# EAGLE design breakout-r1 (EAGLE 8.3.1)
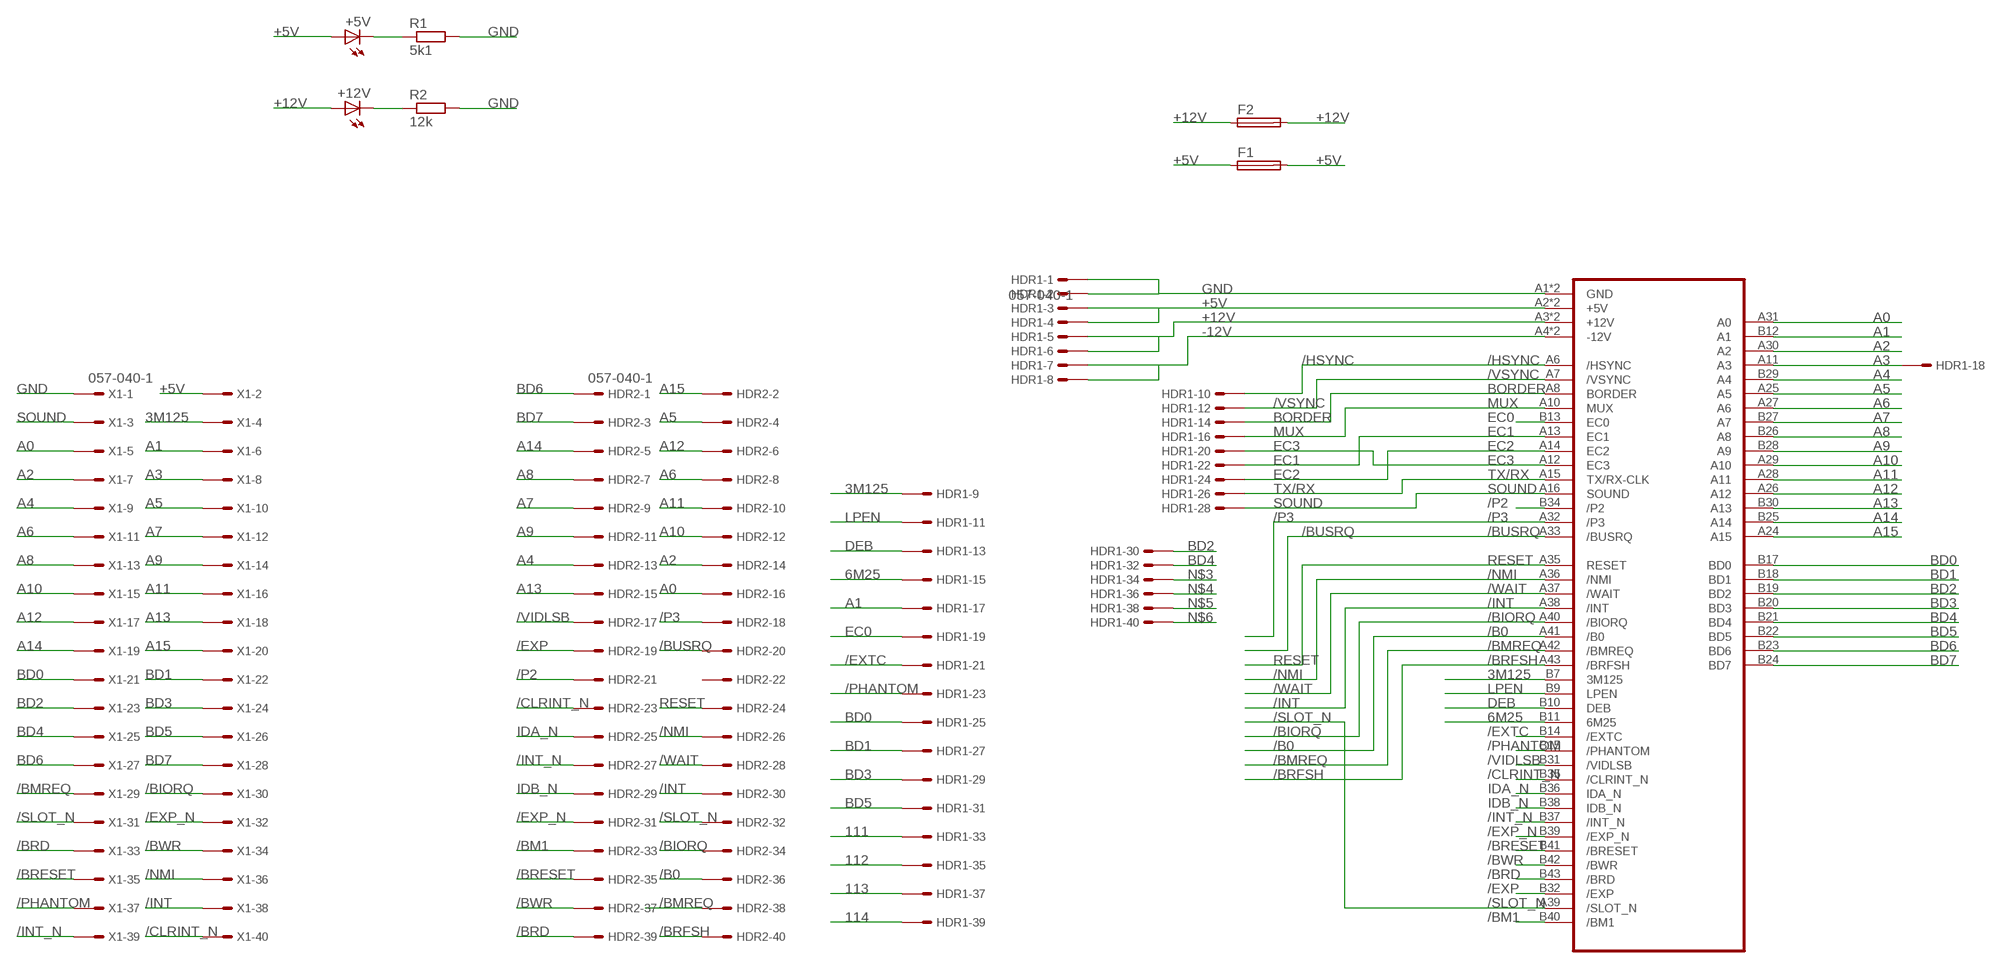
[diagram p0: schematic, sheet 1]

## Parts
+5V  LED3MM  [LED3MM]
+12V  LED3MM  [LED3MM]
F1  TE5  [TE5]
F2  TE5  [TE5]
HDR1  057-040-1  [057-040-1]
HDR2  057-040-1  [057-040-1]
R1  5k1  R-EU_0204/5  [0204/5]
R2  12k  R-EU_0204/5  [0204/5]
U$1  TVC-EXP-HBA-COMMON  [TVC-EXP-EDGE]
X1  057-040-1  [057-040-1]

## Nets
3M125: HDR1.9 U$1.B7(3M125) X1.4
6M25: HDR1.15 U$1.B11(6M25)
111: HDR1.33
112: HDR1.35
113: HDR1.37
114: HDR1.39
+5V [pwr]: +5V.A F1.1 F1.2 HDR1.3 HDR1.4 U$1.A2(+5V) U$1.B2(+5V) X1.2
+12V [pwr]: +12V.A F2.1 F2.2 HDR1.5 HDR1.6 U$1.A3(+12V) U$1.B3(+12V)
-12V [pwr]: HDR1.7 HDR1.8 U$1.A4(-12V) U$1.B4(-12V)
/B0: HDR2.36 U$1.A41(/B0)
/BIORQ: HDR2.34 U$1.A40(/BIORQ) X1.30
/BM1: HDR2.33 U$1.B40(/BM1)
/BMREQ: HDR2.38 U$1.A42(/BMREQ) X1.29
/BRD: HDR2.39 U$1.B43(/BRD) X1.33
/BRESET: HDR2.35 U$1.B41(/BRESET) X1.35
/BRFSH: HDR2.40 U$1.A43(/BRFSH)
/BUSRQ: HDR2.20 U$1.A33(/BUSRQ)
/BWR: HDR2.37 U$1.B42(/BWR) X1.34
/CLRINT_N: HDR2.23 U$1.B35(/CLRINT_N) X1.40
/EXP: HDR2.19 U$1.B32(/EXP)
/EXP_N: HDR2.31 U$1.B39(/EXP_N) X1.32
/EXTC: HDR1.21 U$1.B14(/EXTC)
/HSYNC: HDR1.10 U$1.A6(/HSYNC)
/INT: HDR2.30 U$1.A38(/INT) X1.38
/INT_N: HDR2.27 U$1.B37(/INT_N) X1.39
/NMI: HDR2.26 U$1.A36(/NMI) X1.36
/P2: HDR2.21 U$1.B34(/P2)
/P3: HDR2.18 U$1.A32(/P3)
/PHANTOM: HDR1.23 U$1.B15(/PHANTOM) X1.37
/SLOT_N: HDR2.32 U$1.A39(/SLOT_N) X1.31
/VIDLSB: HDR2.17 U$1.B31(/VIDLSB)
/VSYNC: HDR1.12 U$1.A7(/VSYNC)
/WAIT: HDR2.28 U$1.A37(/WAIT)
A0: HDR2.16 U$1.A31(A0) X1.5
A1: HDR1.17 U$1.B12(A1) X1.6
A2: HDR2.14 U$1.A30(A2) X1.7
A3: HDR1.18 U$1.A11(A3) X1.8
A4: HDR2.13 U$1.B29(A4) X1.9
A5: HDR2.4 U$1.A25(A5) X1.10
A6: HDR2.8 U$1.A27(A6) X1.11
A7: HDR2.9 U$1.B27(A7) X1.12
A8: HDR2.7 U$1.B26(A8) X1.13
A9: HDR2.11 U$1.B28(A9) X1.14
A10: HDR2.12 U$1.A29(A10) X1.15
A11: HDR2.10 U$1.A28(A11) X1.16
A12: HDR2.6 U$1.A26(A12) X1.17
A13: HDR2.15 U$1.B30(A13) X1.18
A14: HDR2.5 U$1.B25(A14) X1.19
A15: HDR2.2 U$1.A24(A15) X1.20
BD0: HDR1.25 U$1.B17(BD0) X1.21
BD1: HDR1.27 U$1.B18(BD1) X1.22
BD2: HDR1.30 U$1.B19(BD2) X1.23
BD3: HDR1.29 U$1.B20(BD3) X1.24
BD4: HDR1.32 U$1.B21(BD4) X1.25
BD5: HDR1.31 U$1.B22(BD5) X1.26
BD6: HDR2.1 U$1.B23(BD6) X1.27
BD7: HDR2.3 U$1.B24(BD7) X1.28
BORDER: HDR1.14 U$1.A8(BORDER)
DEB: HDR1.13 U$1.B10(DEB)
EC0: HDR1.19 U$1.B13(EC0)
EC1: HDR1.22 U$1.A13(EC1)
EC2: HDR1.24 U$1.A14(EC2)
EC3: HDR1.20 U$1.A12(EC3)
GND [pwr]: HDR1.1 HDR1.2 R1.2 R2.2 U$1.A1(GND) U$1.B1(GND) X1.1
IDA_N: HDR2.25 U$1.B36(IDA_N)
IDB_N: HDR2.29 U$1.B38(IDB_N)
LPEN: HDR1.11 U$1.B9(LPEN)
MUX: HDR1.16 U$1.A10(MUX)
N$1: +5V.K(C) R1.1
N$2: +12V.K(C) R2.1
N$3: HDR1.34
N$4: HDR1.36
N$5: HDR1.38
N$6: HDR1.40
RESET: HDR2.24 U$1.A35(RESET)
SOUND: HDR1.28 U$1.A16(SOUND) X1.3
TX/RX: HDR1.26 U$1.A15(TX/RX-CLK)
Unconnected: HDR2.22

## Library data of the parts
+5V +12V = led:LED: LED OSRAM: - CHIPLED LG R971, LG N971, LY N971, LG Q971, LY Q971, LO R971, LY R971 LH N974, LH R974 LS Q976, LO Q976, LY Q976 LO Q996 - Hyper CHIPLED LW Q18S LB Q993, LB Q99A, LB R99A - SideLED LS A670, LO A670, LY A670, LG A670, LP A670 LB A673, LV A673, LT A673, LW A673 LH A674 LY A675 LS A676, LA A676, LO A676, LY A676, LW A676 LS A679, LY A679, LG A679 - Hyper Micro SIDELED® LS Y876, LA Y876, LO Y876, LY Y876 LT Y87S - SmartLED LW L88C, LW L88S LB L89C, LB L89S, LG L890 LS L89K, LO L89K, LY L89K LS L896, LA L896, LO L896, LY L896 - TOPLED LS T670, LO T670, LY T670, LG T670, LP T670 LSG T670, LSP T670, LSY T670, LOP T670, LYG T670 LG T671, LOG T671, LSG T671 LB T673, LV T673, LT T673, LW T673 LH T674 LS T676, LA T676, LO T676, LY T676, LB T676, LH T676, LSB T676, LW T676 LB T67C, LV T67C, LT T67C, LS T67K, LO T67K, LY T67K, LW E67C LS E67B, LA E67B, LO E67B, LY E67B, LB E67C, LV E67C, LT E67C LW T67C LS T679, LY T679, LG T679 LS T770, LO T770, LY T770, LG T770, LP T770 LB T773, LV T773, LT T773, LW T773 LH T774 LS E675, LA E675, LY E675, LS T675 LS T776, LA T776, LO T776, LY T776, LB T776 LHGB T686 LT T68C, LB T68C - Hyper Mini TOPLED® LB M676 - Mini TOPLED Santana® LG M470 LS M47K, LO M47K, LY M47K Source: http://www.osram.convergy.de LUXEON: - LUMILED® LXK2-PW12-R00, LXK2-PW12-S00, LXK2-PW14-U00, LXK2-PW14-V00 LXK2-PM12-R00, LXK2-PM12-S00, LXK2-PM14-U00 LXK2-PE12-Q00, LXK2-PE12-R00, LXK2-PE12-S00, LXK2-PE14-T00, LXK2-PE14-U00 LXK2-PB12-K00, LXK2-PB12-L00, LXK2-PB12-M00, LXK2-PB14-N00, LXK2-PB14-P00, LXK2-PB14-Q00 LXK2-PR12-L00, LXK2-PR12-M00, LXK2-PR14-Q00, LXK2-PR14-R00 LXK2-PD12-Q00, LXK2-PD12-R00, LXK2-PD12-S00 LXK2-PH12-R00, LXK2-PH12-S00 LXK2-PL12-P00, LXK2-PL12-Q00, LXK2-PL12-R00 Source: www.luxeon.com KINGBRIGHT: KA-3528ASYC Source: www.kingbright.com
F1 F2 = fuse:TE5: FUSE Wickmann; OC_FARNELL: unknown; OC_NEWARK: unknown
HDR1 HDR2 X1 = con-panduit:057-040-: CONNECTOR 40-pin series 057 contact pc board low profile headers; OC_FARNELL: unknown; OC_NEWARK: unknown
R1 R2 = resistor:R-EU_: RESISTOR, European symbol
U$1 = tvc-exp:TVC-EXP-HBA-COMMON: Videoton TV-Computer expansion port edge connector, common pins for 32k, 64k and 64k+

## Net classes
0 default: width 0.254 mm
1 pwr: width 0.508 mm, clearance 0.254 mm

## Board
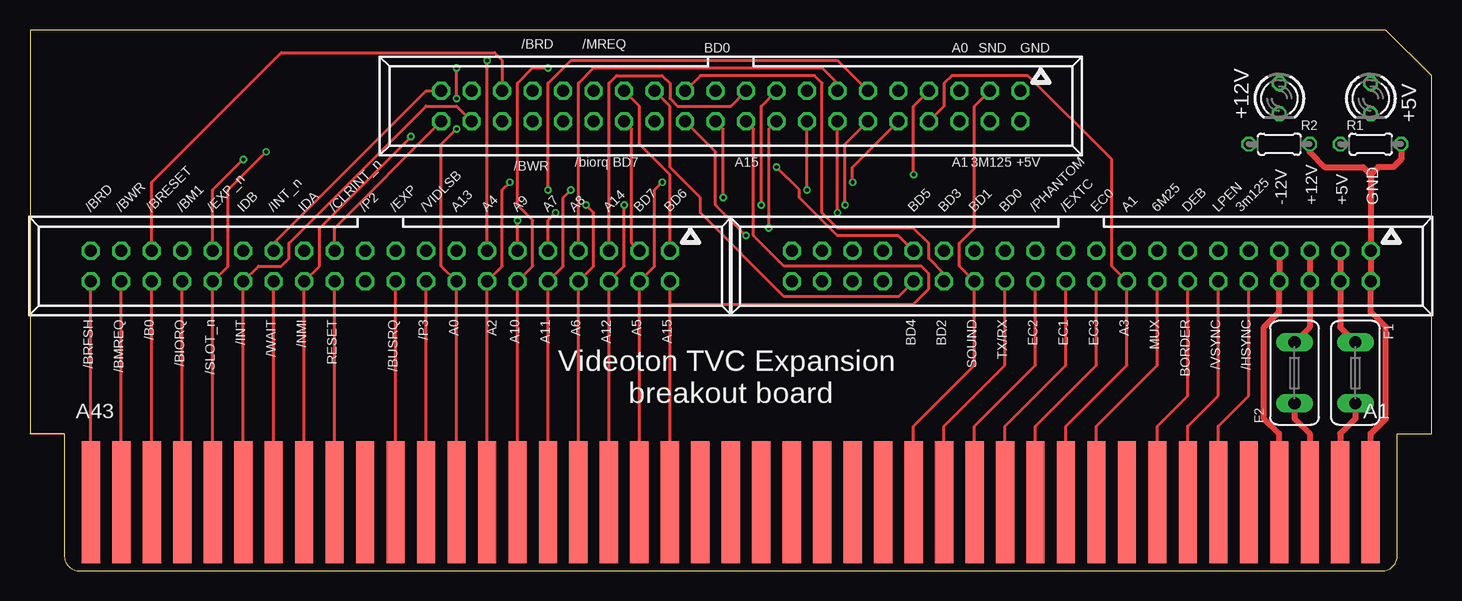
[diagram p1: board, top side]
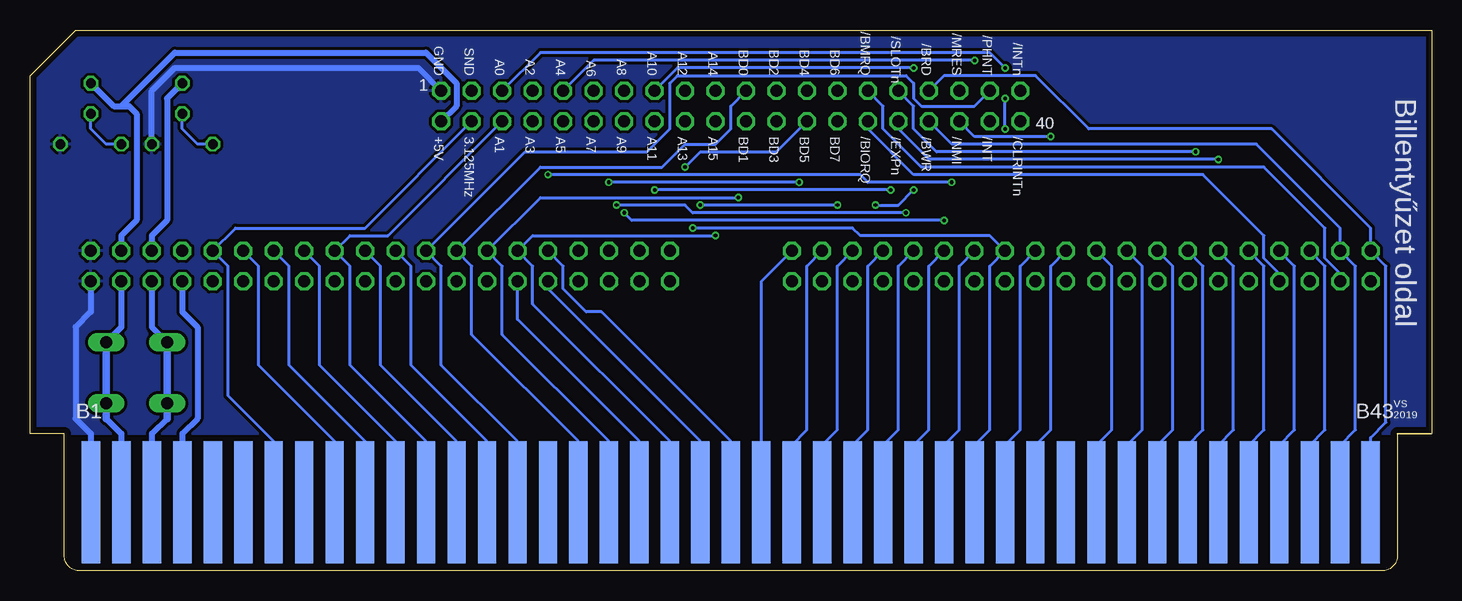
[diagram p2: board, bottom side, seen from below]

Size 116.84 x 45.08 mm. Coordinates in mm from the lower left corner, seen from the top.
Outline: 113.98,11.43 116.84,11.43 116.84,41.27 113.03,45.08 0,45.08 0,11.43 2.86,11.43
Copper layers (1*16): Top 0.035mm / dielectric 1.6mm / Bottom 0.035mm
Design rules "Elecrow_2-layer_PCB_eagle_rule": minimum track width 6mil, minimum drill 12mil, track to track 6mil, track to pad 6mil, pad to pad 6mil, via to via 8mil, smd to smd 0mil, copper to edge 20mil, drill to drill 10mil, minimum pad ring 6mil, minimum via ring 6mil, stop-mask expansion 0mil, vias tented up to drill 100mil, thermal gap 10mil

### Footprints (pad centres in the part's own frame; a part is rotated, then mirrored left to right if it is on the bottom)
LED3MM = drill 0.813 octagon: A -1.27,0; K 1.27,0
TE5 = drill 1.016 long: 1 -2.54,0; 2 2.54,0
057-040-1 = drill 1 octagon: 1 -24.13,-1.27; 2 -24.13,1.27; 3 -21.59,-1.27; 4 -21.59,1.27; 5 -19.05,-1.27; 6 -19.05,1.27; 7 -16.51,-1.27; 8 -16.51,1.27; 9 -13.97,-1.27; 10 -13.97,1.27; 11 -11.43,-1.27; 12 -11.43,1.27; 13 -8.89,-1.27; 14 -8.89,1.27; 15 -6.35,-1.27; 16 -6.35,1.27; 17 -3.81,-1.27; 18 -3.81,1.27; 19 -1.27,-1.27; 20 -1.27,1.27; 21 1.27,-1.27; 22 1.27,1.27; 23 3.81,-1.27; 24 3.81,1.27; 25 6.35,-1.27; 26 6.35,1.27; 27 8.89,-1.27; 28 8.89,1.27; 29 11.43,-1.27; 30 11.43,1.27; 31 13.97,-1.27; 32 13.97,1.27; 33 16.51,-1.27; 34 16.51,1.27; 35 19.05,-1.27; 36 19.05,1.27; 37 21.59,-1.27; 38 21.59,1.27; 39 24.13,-1.27; 40 24.13,1.27
0204/5 = drill 0.813 octagon: 1 -2.54,0; 2 2.54,0
TVC-EXP-EDGE = smd 1.524 x 10.16: A1 53.34,-5.715; A2 50.8,-5.715; A3 48.26,-5.715; A4 45.72,-5.715; A5 43.18,-5.715; A6 40.64,-5.715; A7 38.1,-5.715; A8 35.56,-5.715; A9 33.02,-5.715; A10 30.48,-5.715; A11 27.94,-5.715; A12 25.4,-5.715; A13 22.86,-5.715; A14 20.32,-5.715; A15 17.78,-5.715; A16 15.24,-5.715; A17 12.7,-5.715; A18 10.16,-5.715; A19 7.62,-5.715; A20 5.08,-5.715; A21 2.54,-5.715; A22 0,-5.715; A23 -2.54,-5.715; A24 -5.08,-5.715; A25 -7.62,-5.715; A26 -10.16,-5.715; A27 -12.7,-5.715; A28 -15.24,-5.715; A29 -17.78,-5.715; A30 -20.32,-5.715; A31 -22.86,-5.715; A32 -25.4,-5.715; A33 -27.94,-5.715; A34 -30.48,-5.715; A35 -33.02,-5.715; A36 -35.56,-5.715; A37 -38.1,-5.715; A38 -40.64,-5.715; A39 -43.18,-5.715; A40 -45.72,-5.715; A41 -48.26,-5.715; A42 -50.8,-5.715; A43 -53.34,-5.715 | smd 1.524 x 10.16 bottom: B1 53.34,-5.715; B2 50.8,-5.715; B3 48.26,-5.715; B4 45.72,-5.715; B5 43.18,-5.715; B6 40.64,-5.715; B7 38.1,-5.715; B8 35.56,-5.715; B9 33.02,-5.715; B10 30.48,-5.715; B11 27.94,-5.715; B12 25.4,-5.715; B13 22.86,-5.715; B14 20.32,-5.715; B15 17.78,-5.715; B16 15.24,-5.715; B17 12.7,-5.715; B18 10.16,-5.715; B19 7.62,-5.715; B20 5.08,-5.715; B21 2.54,-5.715; B22 0,-5.715; B23 -2.54,-5.715; B24 -5.08,-5.715; B25 -7.62,-5.715; B26 -10.16,-5.715; B27 -12.7,-5.715; B28 -15.24,-5.715; B29 -17.78,-5.715; B30 -20.32,-5.715; B31 -22.86,-5.715; B32 -25.4,-5.715; B33 -27.94,-5.715; B34 -30.48,-5.715; B35 -33.02,-5.715; B36 -35.56,-5.715; B37 -38.1,-5.715; B38 -40.64,-5.715; B39 -43.18,-5.715; B40 -45.72,-5.715; B41 -48.26,-5.715; B42 -50.8,-5.715; B43 -53.34,-5.715

### Placement (x,y rotation side)
+5V  111.76,39.37 270 top
+12V  104.14,39.37 270 top
F1  110.49,16.51 90 top
F2  105.41,16.51 90 top
HDR1  87.63,25.4 180 top
HDR2  29.21,25.4 180 top
R1  111.76,35.56 0 top
R2  104.14,35.56 0 top
U$1  58.42,11.43 0 top
X1  58.42,38.73 180 top

### Tracks (layer width: path | path; a pad name or v marks a point on that pad's centre or on a via)
3M125
  Bottom 0.254: U$1.B7 96.52,10.79 100.33,14.61 100.33,25.4 HDR1.9 99.7,28.57 88.9,28.57 X1.4
6M25
  Bottom 0.254: HDR1.15 92.71,25.4 92.71,17.14 86.36,10.79 U$1.B11
+5V
  Top 0.508: HDR1.3 HDR1.4 109.22,20.32 F1.2 | F1.1 110.49,12.7 109.22,11.43 U$1.B2
  Bottom 0.508: HDR1.4 109.22,20.32 F1.2 | 110.49,12.7 109.22,11.43 U$1.B2 | +5V.A 109.86,38.73 109.22,38.73 | 109.22,38.73 108.59,38.73 107.95,38.1 107.95,29.21 109.22,27.94 HDR1.3 | X1.2 81.28,38.73 81.28,40.64 83.82,43.18 104.78,43.18 109.22,38.73
  Bottom 0.61: F1.2 F1.1 110.49,12.7
+12V
  Top 0.508: HDR1.5 HDR1.6 106.68,20.32 F2.2 | F2.1 105.41,12.7 106.68,11.43 U$1.B3
  Bottom 0.508: HDR1.6 106.68,20.32 F2.2 | 105.41,12.7 106.68,11.43 U$1.B3 | +12V.A 105.41,39.37 105.41,29.21 106.68,27.94 HDR1.5
  Bottom 0.61: F2.2 F2.1 105.41,12.7
-12V
  Top 0.508: HDR1.7 HDR1.8 104.14,21.59 102.87,20.32 102.87,12.7 104.14,11.43 U$1.B4
  Bottom 0.508: HDR1.8 104.14,21.59 102.87,20.32 102.87,12.7 104.14,11.43 U$1.B4
/B0
  Top 0.254: U$1.A41 HDR2.36
/BIORQ
  Top 0.254: U$1.A40 HDR2.34
  Bottom 0.254: X1.30 46.99,36.83 43.18,33.02 19.05,33.02 13.97,27.94 13.97,26.04 12.7,24.77 HDR2.34
/BM1
  Bottom 0.254: HDR2.33 11.43,25.4 11.43,11.75 12.7,10.48 U$1.B40
/BMREQ
  Top 0.254: U$1.A42 HDR2.38
  Bottom 0.254: X1.29 45.72,38.73 45.72,36.83 42.54,33.66 13.97,33.66 8.89,28.57 8.89,26.04 7.62,24.77 HDR2.38
/BRD
  Bottom 0.254: U$1.B43 5.08,11.11 3.81,12.38 3.81,25.4 HDR2.39 5.08,28.57 13.34,36.83 28.57,36.83 33.02,41.27 40.64,41.27 X1.33
/BRESET
  Top 0.254: X1.35 39.37,42.55 38.73,43.18 20.96,43.18 10.16,32.38 HDR2.35
  Bottom 0.254: HDR2.35 8.89,25.4 8.89,11.75 10.16,10.48 U$1.B41
/BRFSH
  Top 0.254: U$1.A43 HDR2.40
/BUSRQ
  Top 0.254: U$1.A33 HDR2.20
/BWR
  Bottom 0.254: U$1.B42 7.62,10.48 6.35,11.75 6.35,25.4 HDR2.37 7.62,28.57 14.61,35.56 40,35.56 X1.34
/CLRINT_N
  Top 0.254: X1.40 25.4,28.57 HDR2.23
  Bottom 0.254: HDR2.23 24.13,25.4 24.13,11.75 25.4,10.48 U$1.B35
/EXP
  Bottom 0.254: HDR2.19 31.75,25.4 31.75,11.75 33.02,10.48 U$1.B32
/EXP_N  (via drill 0.3)
  Top 0.254: v17.78,34.29 15.24,31.75 HDR2.31
  Bottom 0.254: HDR2.31 13.97,25.4 13.97,11.75 15.24,10.48 U$1.B39 | X1.32 44.45,36.83 41.91,34.29 v17.78,34.29
/EXTC
  Bottom 0.254: U$1.B14 78.74,10.79 85.09,17.14 85.09,25.4 HDR1.21
/HSYNC
  Top 0.254: HDR1.10 101.6,14.61 99.06,12.06 U$1.A6
/INT
  Top 0.254: U$1.A38 HDR2.30 19.05,25.4 20.96,25.4 21.59,26.04 21.59,27.3 33.02,38.73 35.56,38.73 X1.38
/INT_N
  Top 0.254: X1.39 33.02,40.01 20.32,27.3 HDR2.27
  Bottom 0.254: HDR2.27 19.05,25.4 19.05,11.75 20.32,10.48 U$1.B37
/NMI  (via drill 0.3)
  Top 0.254: U$1.A36 HDR2.26 24.13,25.4 24.13,28.57 v31.75,36.2
  Bottom 0.254: X1.36 38.1,36.2 v31.75,36.2
/P2
  Bottom 0.254: HDR2.21 26.67,25.4 26.67,11.75 27.94,10.48 U$1.B34
/P3
  Top 0.254: U$1.A32 HDR2.18
/PHANTOM
  Bottom 0.254: U$1.B15 76.2,10.79 82.55,17.14 82.55,25.4 HDR1.23 75.56,34.92 65.41,34.92 63.5,36.83 63.5,40.64 62.87,41.27 43.81,41.27 43.18,40.64 43.18,39.37 42.54,38.73 38.1,38.73 X1.37
/SLOT_N  (via drill 0.3)
  Top 0.254: U$1.A39 HDR2.32 16.51,25.4 16.51,31.75 v19.68,34.92
  Bottom 0.254: X1.31 43.18,38.73 43.18,36.83 41.27,34.92 v19.68,34.92
/VIDLSB
  Bottom 0.254: HDR2.17 34.29,25.4 34.29,11.75 35.56,10.48 U$1.B31
/VSYNC
  Top 0.254: HDR1.12 99.06,14.61 96.52,12.06 U$1.A7
/WAIT
  Top 0.254: U$1.A37 HDR2.28
A0  (via drill 0.3)
  Top 0.254: U$1.A31 HDR2.16 34.29,25.4 34.29,35.56 v35.56,36.83 | v35.56,39.37 v35.56,41.91
  Bottom 0.254: X1.5 74.3,43.18 36.83,43.18 v35.56,41.91 | v35.56,36.83 v35.56,39.37
A1
  Bottom 0.254: U$1.B12 83.82,10.79 90.17,17.14 90.17,25.4 HDR1.17 90.17,27.94 87,27.94 X1.6
A2  (via drill 0.3)
  Top 0.254: U$1.A30 HDR2.14 39.37,25.4 39.37,31.75 v40,32.38 | X1.7 73.66,38.73 v73.66,33.02
  Bottom 0.254: v73.66,33.02 47.62,33.02 46.99,32.38 v40,32.38
A3
  Top 0.254: U$1.A11 86.36,12.06 91.44,17.14 HDR1.18 90.17,25.4 90.17,34.29 83.19,41.27 76.84,41.27 76.2,40.64 76.2,38.73 X1.8
A4  (via drill 0.3)
  Top 0.254: HDR2.13 v38.1,42.55
  Bottom 0.254: HDR2.13 39.37,25.4 39.37,11.75 40.64,10.48 U$1.B29 | X1.9 69.85,42.55 v38.1,42.55
A5  (via drill 0.3)
  Top 0.254: U$1.A25 HDR2.4 52.07,25.4 52.07,31.75 v52.7,32.38 | X1.10 68.58,33.66 v68.58,32.38
  Bottom 0.254: v52.7,32.38 v68.58,32.38
A6  (via drill 0.3)
  Top 0.254: U$1.A27 HDR2.8 46.99,25.4 46.99,29.84 v46.35,30.48 | X1.11 67.31,42.55 45.08,42.55 43.18,40.64 v43.18,31.75
  Bottom 0.254: v43.18,31.75 44.45,30.48 v46.35,30.48
A7  (via drill 0.3)
  Top 0.254: X1.12 67.95,35.56 v67.95,30.48 | v43.81,29.84 43.18,29.21 HDR2.9
  Bottom 0.254: HDR2.9 44.45,25.4 44.45,11.75 45.72,10.48 U$1.B27 | v67.95,30.48 62.23,30.48 61.59,29.84 v43.81,29.84
A8
  Top 0.254: X1.13 67.31,40.64 66.04,41.91 46.99,41.91 45.72,40.64 HDR2.7
  Bottom 0.254: HDR2.7 46.99,25.4 46.99,11.75 48.26,10.48 U$1.B26
A9  (via drill 0.3)
  Top 0.254: v67.31,29.84 X1.14 | HDR2.11 v40.64,29.21
  Bottom 0.254: HDR2.11 41.91,25.4 41.91,11.75 43.18,10.48 U$1.B28 | v67.31,29.84 66.67,29.21 v40.64,29.21
A10  (via drill 0.3)
  Top 0.254: U$1.A29 HDR2.12 41.91,25.4 41.91,29.21 40.64,30.48 40.64,40.64 41.91,41.91 v43.18,41.91
  Bottom 0.254: X1.15 62.87,41.91 v43.18,41.91
A11  (via drill 0.3)
  Top 0.254: U$1.A28 HDR2.10 44.45,25.4 44.45,31.11 v45.08,31.75 | v64.77,31.75 X1.16
  Bottom 0.254: v45.08,31.75 v64.77,31.75
A12  (via drill 0.3)
  Top 0.254: U$1.A26 HDR2.6 49.53,25.4 v49.53,30.48 | X1.17 60.96,38.73 v60.96,30.48
  Bottom 0.254: v49.53,30.48 v60.96,30.48
A13  (via drill 0.3)
  Top 0.254: X1.18 61.59,36.83 v61.59,28.57
  Bottom 0.254: U$1.B30 38.1,10.48 36.83,11.75 36.83,25.4 HDR2.15 36.83,27.94 47.62,27.94 48.26,28.57 v61.59,28.57
A14
  Top 0.254: X1.19 58.42,38.73 53.97,38.73 53.34,39.37 53.34,40.64 52.7,41.27 48.89,41.27 48.26,40.64 HDR2.5
  Bottom 0.254: HDR2.5 49.53,25.4 49.53,11.75 50.8,10.48 U$1.B25
A15
  Top 0.254: U$1.A24 53.34,22.23 | 53.34,22.23 HDR2.2 | X1.20 60.32,36.83 60.32,27.94 62.87,25.4 74.3,25.4 74.93,24.77 74.93,23.5 73.66,22.23 53.34,22.23
BD0
  Bottom 0.254: U$1.B17 71.12,10.79 80.01,19.68 80.01,25.4 HDR1.25 74.3,33.66 64.14,33.66 62.23,35.56 59.69,35.56 58.42,36.83 58.42,38.73 X1.21
BD1  (via drill 0.3)
  Top 0.254: X1.22 57.78,36.83 v57.78,31.11
  Bottom 0.254: U$1.B18 68.58,10.79 77.47,19.68 77.47,25.4 HDR1.27 74.3,31.11 v57.78,31.11
BD2
  Top 0.254: X1.23 55.88,41.27 65.41,41.27 66.04,40.64 66.04,29.84 67.31,28.57 73.66,28.57 74.93,27.3 74.93,26.04 76.2,24.77 HDR1.30
  Bottom 0.254: HDR1.30 76.2,20.95 66.04,10.79 U$1.B19
BD3  (via drill 0.3)
  Top 0.254: X1.24 57.15,34.92 57.15,30.48 v59.69,27.94
  Bottom 0.254: U$1.B20 63.5,10.79 74.93,22.23 74.93,25.4 HDR1.29 74.93,27.94 v59.69,27.94
BD4
  Top 0.254: X1.25 53.34,38.73 53.34,33.66 55.88,31.11 55.88,29.84 62.87,22.86 72.39,22.86 HDR1.32
  Bottom 0.254: HDR1.32 73.66,23.5 60.96,10.79 U$1.B21
BD5  (via drill 0.3)
  Top 0.254: v62.23,33.66 64.14,31.75 64.14,31.11 67.31,27.94 72.39,27.94 HDR1.31
  Bottom 0.254: HDR1.31 72.39,25.4 72.39,23.5 70.48,21.59 69.22,21.59 58.42,10.79 U$1.B22 | X1.26 54.61,34.92 60.96,34.92 v62.23,33.66
BD6
  Top 0.254: X1.27 50.8,38.73 50.8,35.56 53.34,33.02 HDR2.1
  Bottom 0.254: HDR2.1 55.88,24.13 U$1.B23
BD7
  Top 0.254: X1.28 50.16,36.83 50.16,27.3 HDR2.3
  Bottom 0.254: HDR2.3 52.07,25.4 52.07,11.75 53.34,10.48 U$1.B24
BORDER
  Top 0.254: HDR1.14 96.52,14.61 93.98,12.06 U$1.A8
DEB
  Bottom 0.254: HDR1.13 95.25,25.4 95.25,17.14 88.9,10.79 U$1.B10
EC0
  Bottom 0.254: HDR1.19 87.63,25.4 87.63,17.14 81.28,10.79 U$1.B13
EC1
  Top 0.254: HDR1.22 86.36,17.14 81.28,12.06 U$1.A13
EC2
  Top 0.254: HDR1.24 83.82,17.14 78.74,12.06 U$1.A14
EC3
  Top 0.254: HDR1.20 88.9,17.14 83.82,12.06 U$1.A12
GND
  Top 0.508: U$1.B1 111.76,11.43 113.03,12.7 113.03,20.32 111.76,21.59 HDR1.2 HDR1.1 111.76,33.02 | R2.2 106.68,34.92 107.95,33.66 111.12,33.66 111.76,33.02 | R1.2 114.3,34.29 113.67,33.66 112.4,33.66 111.76,33.02
  Bottom 0.508: HDR1.2 111.76,21.59 113.03,20.32 113.03,12.7 111.76,11.43 U$1.B1 | X1.1 84.45,41.91 104.78,41.91 106.68,40.01 R2.2
  pour Bottom: -1.27,45.72 -1.27,11.43 118.11,11.43 118.11,45.72
IDA_N
  Bottom 0.254: HDR2.25 21.59,25.4 21.59,11.75 22.86,10.48 U$1.B36
IDB_N
  Bottom 0.254: HDR2.29 16.51,25.4 16.51,11.75 17.78,10.48 U$1.B38
LPEN
  Bottom 0.254: HDR1.11 97.79,25.4 97.79,17.14 91.44,10.79 U$1.B9
MUX
  Top 0.254: HDR1.16 93.98,17.14 88.9,12.06 U$1.A10
N$1
  Bottom 0.254: R1.1 110.49,35.56 111.76,36.83 +5V.K
N$2
  Bottom 0.254: R2.1 102.87,35.56 104.14,36.83 +12V.K
RESET
  Top 0.254: U$1.A35 HDR2.24
SOUND
  Top 0.254: U$1.A16 73.66,12.06 78.74,17.14 HDR1.28 77.47,25.4 77.47,27.3 78.74,28.57 78.74,38.73 X1.3
TX/RX
  Top 0.254: HDR1.26 81.28,17.14 76.2,12.06 U$1.A15

### Text on the board
tPlace: /BRD | /MREQ | BD0 | A0 | SND | GND | /biorq | BD7 | A15 | A1 | 3M125 | +5V | /BWR | /BRD | /BWR | /BRESET | /BM1 | /EXP_n | IDB | /INT_n | IDA | /CLRINT_n | /P2 | /EXP | /VIDLSB | A13 | A4 | A9 | A7 | A8 | A14 | BD7 | BD6 | BD5 | BD3 | BD1 | BD0 | /PHANTOM | /EXTC | EC0 | A1 | 6M25 | DEB | LPEN | 3m125 | -12V | +12V | +5V | GND | /BRFSH | /BMREQ | /B0 | /BIORQ | /SLOT_n | /INT | /WAIT | /NMI | RESET | /BUSRQ | /P3 | A0 | A2 | A10 | A11 | A6 | A12 | A5 | A15 | BD4 | BD2 | SOUND | TX/RX | EC2 | EC1 | EC3 | A3 | MUX | BORDER | /VSYNC | /HSYNC | Videoton TVC Expansion / breakout board
bPlace: A6 | /INTn | /PHNT | /MRES | /BRD | /SLOTn | /BMRQ | BD6 | BD4 | BD2 | BD0 | A14 | A12 | A10 | A8 | A4 | A2 | A0 | SND | GND | 1 | 40 | /CLRINTn | /INT | /NMI | /BWR | /EXPn | /BIORQ | BD7 | BD5 | BD3 | BD1 | A15 | A13 | A11 | A9 | A7 | A5 | A3 | A1 | 3.125MHz | +5V | Billentyűzet oldal | VS / 2019